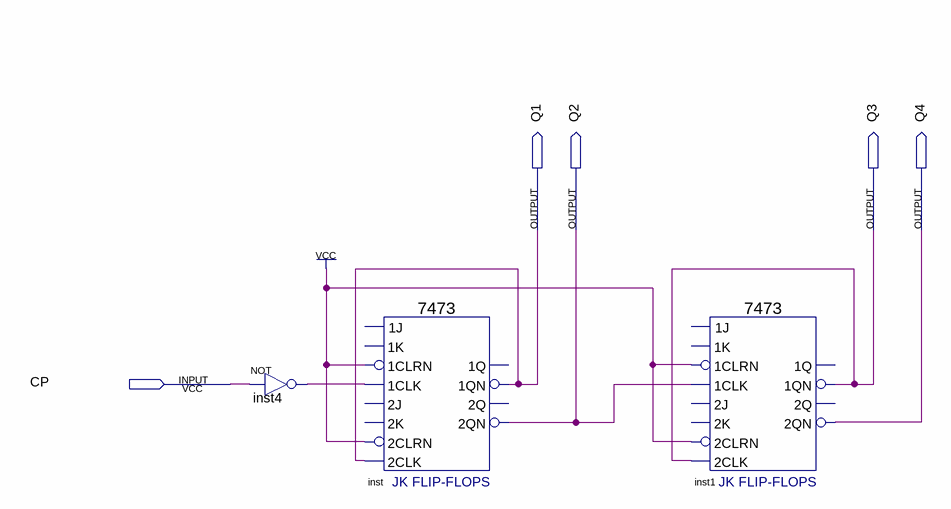
[diagram p0: schematic sheet]
// Quartus schematic pj701_2.bdf as structural Verilog: 3 symbols, 5 pins
module pj701_2 (
  input  CP,
  output Q1,
  output Q2,
  output Q3,
  output Q4
);

  wire inst4_out;

  not inst4 (inst4_out, CP);
  \7473  inst (
    .\1CLRN (1'b1), .\1CLK (inst4_out), .\2CLK (Q1), .\2CLRN (1'b1), .\1QN (Q1), .\2QN (Q2));  // open: 1J, 1K, 2J, 2K, 2Q, 1Q
  \7473  inst1 (
    .\1CLRN (1'b1), .\1CLK (Q2), .\2CLK (Q3), .\2CLRN (1'b1), .\1QN (Q3), .\2QN (Q4));  // open: 1J, 1K, 2J, 2K, 2Q, 1Q
endmodule
